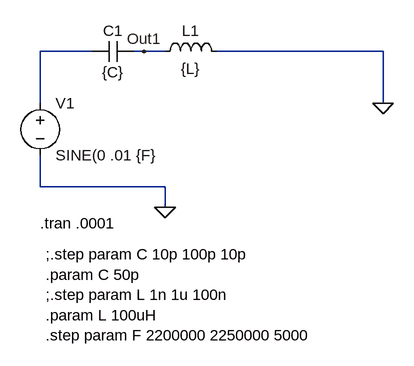
[diagram p0: schematic Accord1.asc]
Accord1.asc, the LTspice schematic file:
Version 4
SHEET 1 880 680
WIRE 48 64 -32 64
WIRE 128 64 112 64
WIRE 160 64 128 64
WIRE 496 64 240 64
WIRE -32 144 -32 64
WIRE 496 144 496 64
WIRE -32 272 -32 224
WIRE 160 272 -32 272
WIRE 160 304 160 272
FLAG 160 304 0
FLAG 128 64 Out1
FLAG 496 144 0
SYMBOL voltage -32 128 R0
WINDOW 123 0 0 Left 0
WINDOW 39 0 0 Left 0
SYMATTR InstName V1
SYMATTR Value SINE(0 .01 {F}
SYMBOL cap 112 48 R90
WINDOW 0 0 32 VBottom 2
WINDOW 3 32 32 VTop 2
SYMATTR InstName C1
SYMATTR Value {C}
SYMBOL ind 144 80 R270
WINDOW 0 32 56 VTop 2
WINDOW 3 5 56 VBottom 2
SYMATTR InstName L1
SYMATTR Value {L}
TEXT -32 328 Left 2 !.tran .0001
TEXT -24 376 Left 2 !;.step param C 10p 100p 10p\n.param C 50p\n;.step param L 1n 1u 100n\n.param L 100uH\n.step param F 2200000 2250000 5000

The netlist it stands for:
* Accord1.asc
V1 N001 0 SINE(0 .01 {F}
C1 Out1 N001 {C}
L1 Out1 0 {L}
.tran .0001
;.step param C 10p 100p 10p
.param C 50p
;.step param L 1n 1u 100n
.param L 100uH
.step param F 2200000 2250000 5000
.backanno
.end